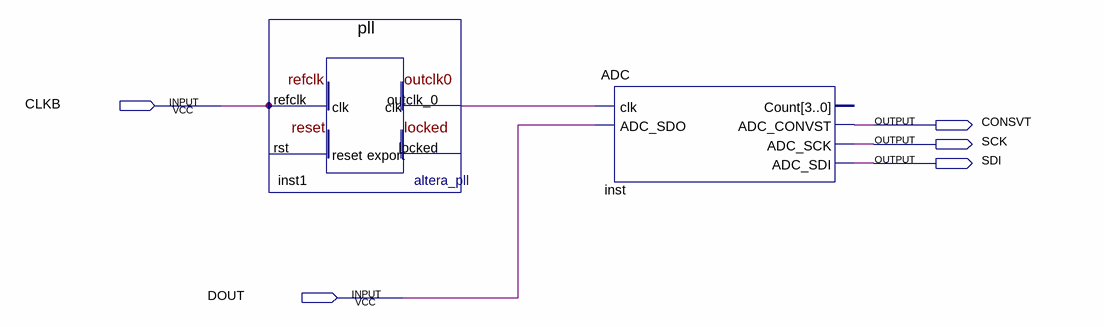
[diagram p0: schematic sheet]
// Quartus schematic schematic.bdf as structural Verilog: 2 symbols, 5 pins
module schematic (
  input  CLKB,
  input  DOUT,
  output CONSVT,
  output SCK,
  output SDI
);

  wire inst1_outclk_0;

  pll inst1 (.refclk(CLKB), .outclk_0(inst1_outclk_0));  // open: rst, locked
  ADC inst (.clk(inst1_outclk_0), .ADC_SDO(DOUT), .ADC_CONVST(CONSVT), .ADC_SCK(SCK), .ADC_SDI(SDI));  // open: Count
endmodule
